# Altium project 2020-04-02-04-30101 - ETC_Interface_PCB.PrjPcb
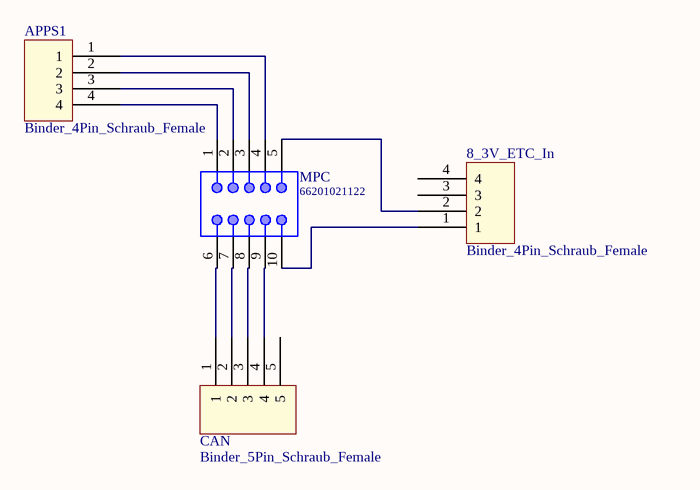
[diagram p0: 2020-04-02-04-30101 - ETC_Interface_Circuit_1.SchDoc]
2 sheets, 9 parts. Net scope: global (net labels, ports and power ports of the same name join across sheets).
Board files: 2020-04-02-04-30101 - PCB1.PcbDoc, 2020-04-02-04-30101 - PCB2.PcbDoc
Sheets:
  2020-04-02-04-30101 - ETC_Interface_Circuit_1.SchDoc
  2020-04-02-04-30101 - ETC_Interface_Circuit_2.SchDoc

## Sheet 2020-04-02-04-30101 - ETC_Interface_Circuit_1.SchDoc
size A4

### Parts
8_3V_ETC_In  Binder_4Pin_Schraub_Female  [09 0412 30 04]
APPS1  Binder_4Pin_Schraub_Female  [09 0412 30 04]
CAN  Binder_5Pin_Schraub_Female  [09 0416 30 05]
MPC  66201021122  [66201021122]

### Nets
Net8_3V_ETC_In_1: 8_3V_ETC_In.1 MPC.10
Net8_3V_ETC_In_2: 8_3V_ETC_In.2 MPC.5
NetAPPS1_1: APPS1.1 MPC.4
NetAPPS1_2: APPS1.2 MPC.3
NetAPPS1_3: APPS1.3 MPC.2
NetAPPS1_4: APPS1.4 MPC.1
NetCAN_1: CAN.1 MPC.6
NetCAN_2: CAN.2 MPC.7
NetCAN_3: CAN.3 MPC.8
NetCAN_4: CAN.4 MPC.9

Not connected (* = marked no-connect by the designer): 8_3V_ETC_In 3 4; CAN 5

### Library data of the parts
MPC = 66201021122: THT Male Header WR-MPC3, Vertical, Dual Row, pitch 3 mm, 10 pins; Pitch: 3 mm; Working Voltage: 250 VAC; Contact Resistance: 10 mOhm; Pin Number: 10; ComponentLink1Description: Manufacturer; ComponentLink1URL: http://www.we-online.de; ComponentLink2Description: Datasheet; ComponentLink2URL: https://katalog.we-online.de/em/datasheet/6620xx21122.pdf; Part Number: 66201021122; Published Date: September 2018; Publisher: Wurth Elektronik; Operating Temperature: -40 to 105 degC; Packaging: Tube; Gender: Male; Mounting Technology: THT; Orientation: Vertical

## Sheet 2020-04-02-04-30101 - ETC_Interface_Circuit_2.SchDoc
size A4
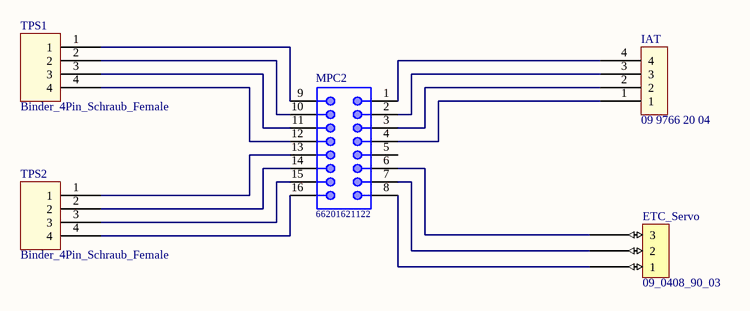
[diagram p1: 2020-04-02-04-30101 - ETC_Interface_Circuit_2.SchDoc]

### Parts
ETC_Servo  09_0408_90_03  [09_0408_90_03]
IAT  09 9766 20 04  [09 9766 20 04]
MPC2  66201621122  [66201621122]
TPS1  Binder_4Pin_Schraub_Female  [09 0412 30 04]
TPS2  Binder_4Pin_Schraub_Female  [09 0412 30 04]

### Nets
NetETC_Servo_1: ETC_Servo.1 MPC2.8
NetETC_Servo_2: ETC_Servo.2 MPC2.7
NetETC_Servo_3: ETC_Servo.3 MPC2.6
NetIAT_1: IAT.1 MPC2.4
NetIAT_2: IAT.2 MPC2.3
NetIAT_3: IAT.3 MPC2.2
NetIAT_4: IAT.4 MPC2.1
NetMPC2_9: MPC2.9 TPS1.1
NetMPC2_10: MPC2.10 TPS1.2
NetMPC2_11: MPC2.11 TPS1.3
NetMPC2_12: MPC2.12 TPS1.4
NetMPC2_13: MPC2.13 TPS2.1
NetMPC2_14: MPC2.14 TPS2.2
NetMPC2_15: MPC2.15 TPS2.3
NetMPC2_16: MPC2.16 TPS2.4

Not connected (* = marked no-connect by the designer): MPC2 5

### Library data of the parts
IAT = 09 9766 20 04: Binder 4 Pin Female SnapIn
MPC2 = 66201621122: THT Male Header WR-MPC3, Vertical, Dual Row, pitch 3 mm, 16 pins; Pitch: 3 mm; Working Voltage: 250 VAC; Contact Resistance: 10 mOhm; Pin Number: 16; ComponentLink1Description: Manufacturer; ComponentLink1URL: http://www.we-online.de; ComponentLink2Description: Datasheet; ComponentLink2URL: https://katalog.we-online.de/em/datasheet/6620xx21122.pdf; Part Number: 66201621122; Published Date: September 2018; Publisher: Wurth Elektronik; Operating Temperature: -40 to 105 degC; Packaging: Tube; Gender: Male; Mounting Technology: THT; Orientation: Vertical